# Altium schematic sheet beaglebone.SchDoc: Beaglebone
size A4; Organization: Badgerloop Electrical; Address1: 133 Engineering Research Building; Address2: 1500 Engineering Drive; Address3: Madison, Wi 53706
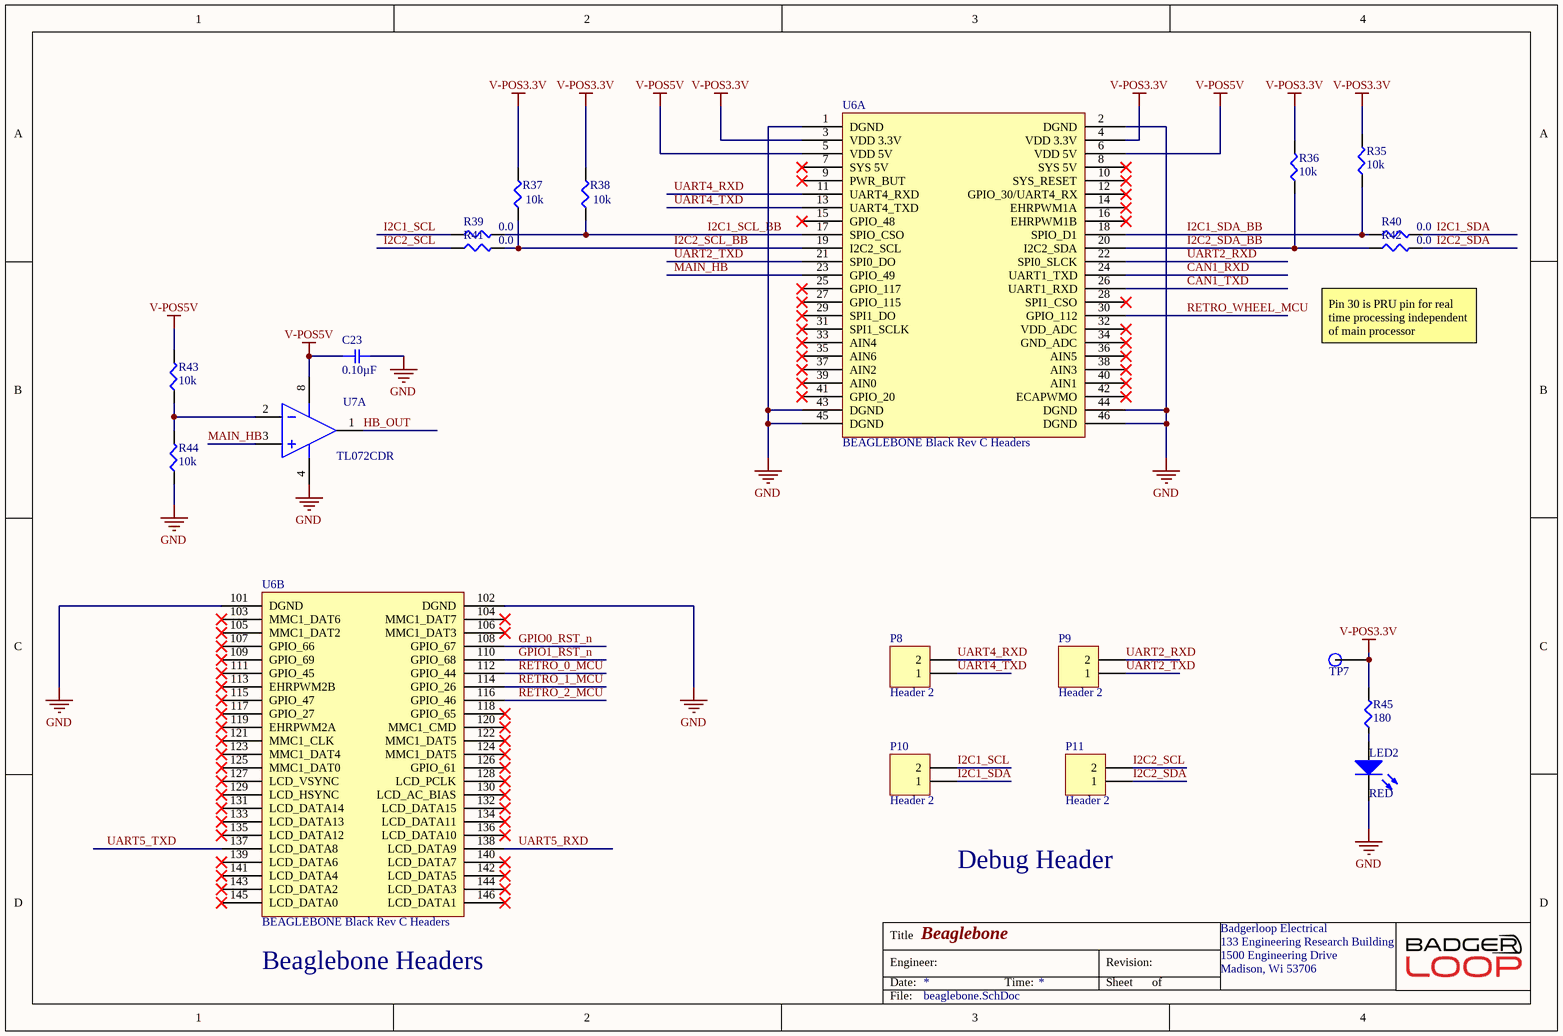
[diagram p0: beaglebone.SchDoc]

## Parts
C23  0.10µF  [SMD-0805C]
LED2  RED  [LED 0603 RED]
P8  Header 2  [Pin Header 1x2 TH Pitch 2.54mm]
P9  Header 2  [Pin Header 1x2 TH Pitch 2.54mm]
P10  Header 2  [Pin Header 1x2 TH Pitch 2.54mm]
P11  Header 2  [Pin Header 1x2 TH Pitch 2.54mm]
R35  10k  [SMD-0805-RES]
R36  10k  [SMD-0805-RES]
R37  10k  [SMD-0805-RES]
R38  10k  [SMD-0805-RES]
R39  0.0  [SMD-1206-RES]
R40  0.0  [SMD-1206-RES]
R41  0.0  [SMD-1206-RES]
R42  0.0  [SMD-1206-RES]
R43  10k  [SMD-0805-RES]
R44  10k  [SMD-0805-RES]
R45  180  [SMD-0805-RES]
TP7  TP  [Test Point]  (value not drawn)
U6  BEAGLEBONE Black Rev C Headers  [Beaglebone_Topside]  (parts A,B of 2)
U7  TL072CDR  [SOP127P600X175-8N]  (part A of 2)

## Nets
GND: C23.2 LED2.2(K) R44.1 U6.1(DGND) U6.2(DGND) U6.43(DGND) U6.44(DGND) U6.45(DGND) U6.46(DGND) U6.101(DGND) U6.102(DGND) U7.4(V-)
V-POS3.3V: R35.2 R36.2 R37.2 R38.2 R45.2 TP7.1 U6.3(VDD_3.3V) U6.4(VDD_3.3V)
V-POS5V: C23.1 R43.2 U6.5(VDD_5V) U6.6(VDD_5V) U7.8(V+)
CAN1_RXD: U6.24(UART1_TXD)
CAN1_TXD: U6.26(UART1_RXD)
GPIO0_RST_n: U6.108(GPIO_67)
GPIO1_RST_n: U6.110(GPIO_68)
HB_OUT: U7.1(OUT)
I2C1_SCL: P10.2 R39.1
I2C1_SCL_BB: R38.1 R39.2 U6.17(SPIO_CSO)
I2C1_SDA: P10.1 R40.2
I2C1_SDA_BB: R35.1 R40.1 U6.18(SPIO_D1)
I2C2_SCL: P11.2 R41.1
I2C2_SCL_BB: R37.1 R41.2 U6.19(I2C2_SCL)
I2C2_SDA: P11.1 R42.2
I2C2_SDA_BB: R36.1 R42.1 U6.20(I2C2_SDA)
MAIN_HB: U6.23(GPIO_49) U7.3(IN+)
RETRO_0_MCU: U6.112(GPIO_44)
RETRO_1_MCU: U6.114(GPIO_26)
RETRO_2_MCU: U6.116(GPIO_46)
RETRO_WHEEL_MCU: U6.30(GPIO_112)
UART2_RXD: P9.2 U6.22(SPI0_SLCK)
UART2_TXD: P9.1 U6.21(SPI0_DO)
UART4_RXD: P8.2 U6.11(UART4_RXD)
UART4_TXD: P8.1 U6.13(UART4_TXD)
UART5_RXD: U6.138(LCD_DATA9)
UART5_TXD: U6.137(LCD_DATA8)
NetLED2_1: LED2.1(A) R45.1
NetR43_1: R43.1 R44.2 U7.2(IN-)

Not connected (* = marked no-connect by the designer): U6 7(SYS_5V)* 8(SYS_5V)* 9(PWR_BUT)* 10(SYS_RESET)* 12(GPIO_30/UART4_RX)* 14(EHRPWM1A)* 15(GPIO_48)* 16(EHRPWM1B)* 25(GPIO_117)* 27(GPIO_115)* 28(SPI1_CSO)* 29(SPI1_DO)* 31(SPI1_SCLK)* 32(VDD_ADC)* 33(AIN4)* 34(GND_ADC)* 35(AIN6)* 36(AIN5)* 37(AIN2)* 38(AIN3)* 39(AIN0)* 40(AIN1)* 41(GPIO_20)* 42(ECAPWMO)* 103(MMC1_DAT6)* 104(MMC1_DAT7)* 105(MMC1_DAT2)* 106(MMC1_DAT3)* 107(GPIO_66)* 109(GPIO_69)* 111(GPIO_45)* 113(EHRPWM2B)* 115(GPIO_47)* 117(GPIO_27)* 118(GPIO_65)* 119(EHRPWM2A)* 120(MMC1_CMD)* 121(MMC1_CLK)* 122(MMC1_DAT5)* 123(MMC1_DAT4)* 124(MMC1_DAT5)* 125(MMC1_DAT0)* 126(GPIO_61)* 127(LCD_VSYNC)* 128(LCD_PCLK)* 129(LCD_HSYNC)* 130(LCD_AC_BIAS)* 131(LCD_DATA14)* 132(LCD_DATA15)* 133(LCD_DATA13)* 134(LCD_DATA11)* 135(LCD_DATA12)* 136(LCD_DATA10)* 139(LCD_DATA6)* 140(LCD_DATA7)* 141(LCD_DATA4)* 142(LCD_DATA5)* 143(LCD_DATA2)* 144(LCD_DATA3)* 145(LCD_DATA0)* 146(LCD_DATA1)*

## Notes on the sheet
- Pin 30 is PRU pin for real time processing independent of main processor
- Debug Header
- (near U6) Beaglebone Headers
- Title
- Engineer:
- Date:
- Time:
- Revision:
- Sheet
- of
- File:

## Library data of the parts
C23 = GRM21B7U1A104JA01L: CAP CER 0.1UF 10V U2J 0805; Manufacturer: Murata Electronics North America; Factory Stock: 0; Unit Price (USD): 0.4; Minimum Quantity: 1; Tolerance: ±5%; Datasheets: http://www.murata.com/~/media/webrenewal/support/library/catalog/products/capacitor/mlcc/c02e.pdf; Image: //media.digikey.com/Renders/Murata%20Renders/0805%20(2012%20Metric)%20.85mm.jpg; Digi-Key Part Number: 490-11592-1-ND; Part Number: GRM21B7U1A104JA01L; Quantity Available: 3390; @ qty: 0; Packaging: Cut Tape (CT); Series: GRM; Part Status: Active; Value: 0.10µF; Voltage: 10V; Temperature Coefficient: U2J; Operating Temperature: -55°C ~ 125°C; Features: -; Ratings: -; Applications: General Purpose; Mounting Type: Surface Mount, MLCC; Package / Case: 0805 (2012 Metric); Size / Dimension: 0.079" L x 0.049" W (2.00mm x 1.25mm); Height - Seated (Max): -; Thickness (Max): 0.053" (1.35mm); Lead Spacing: -; Lead Style: -
LED2 = LED RED 0603: Red 631nm LED Indication - Discrete 2V 0603 (1608 Metric); Manufacturer: Lite-On Inc.; Manufacturer P/N: LTST-C190KRKT; Digikey P/N: 160-1436-1-ND; Package / Case: 0603; Color: RED
P8-P11 = Header 2: Header, 2-Pin; LatestRevisionDate: 17-Jul-2002; LatestRevisionNote: Re-released for DXP Platform.; Publisher: Altium Limited
R35-R38 = ERJ-6GEYJ103V: RES SMD 10K OHM 5% 1/8W 0805; Manufacturer: Panasonic Electronic Components; Factory Stock: 0; Unit Price (USD): 0.00496; @ qty: 1500; Minimum Quantity: 1; Power (Watts): 0.125W, 1/8W; Temperature Coefficient: ±200ppm/°C; Part Number: ERJ-6GEYJ103V; Datasheets: http://industrial.panasonic.com/www-cgi/jvcr13pz.cgi?E+PZ+3+AOA0001+ERJ6GEYJ103V+7+WW; Image: //media.digikey.com/Renders/Panasonic%20Renders/ERJ-0805%20Pkg.jpg; Digi-Key Part Number: P10KACT-ND; Quantity Available: 2328224; Packaging: Cut Tape (CT); Series: ERJ; Part Status: Active; Value: 10k; Tolerance: ±5%; Composition: Thick Film; Features: Automotive AEC-Q200; Operating Temperature: -55°C ~ 155°C; Package / Case: 0805 (2012 Metric); Supplier Device Package: 0805; Size / Dimension: 0.079" L x 0.049" W (2.00mm x 1.25mm); Height - Seated (Max): 0.028" (0.70mm); Number of Terminations: 2; Failure Rate: -
R39-R42 = ERJ-8GEY0R00V: RES SMD 0.0 OHM JUMPER 1/4W 1206; Manufacturer: Panasonic Electronic Components; Factory Stock: 0; Unit Price (USD): 0.00768; @ qty: 1500; Minimum Quantity: 1; Power (Watts): 0.25W, 1/4W; Part Number: ERJ-8GEY0R00V; Datasheets: http://industrial.panasonic.com/www-cgi/jvcr13pz.cgi?E+PZ+3+AOA0001+ERJ8GEY0R00V+7+WW; Image: //media.digikey.com/Renders/Panasonic%20Renders/ERJ-1206%20Pkg.jpg; Digi-Key Part Number: P0.0ECT-ND; Quantity Available: 1074190; Packaging: Cut Tape (CT); Series: ERJ; Part Status: Active; Value: 0.0; Tolerance: Jumper; Composition: Thick Film; Features: Automotive AEC-Q200; Temperature Coefficient: -; Operating Temperature: -55°C ~ 155°C; Package / Case: 1206 (3216 Metric); Supplier Device Package: 1206; Size / Dimension: 0.126" L x 0.063" W (3.20mm x 1.60mm); Height - Seated (Max): 0.028" (0.70mm); Number of Terminations: 2; Failure Rate: -
R43 R44 = ERJ-P06J103V: RES SMD 10K OHM 5% 1/2W 0805; Manufacturer: Panasonic Electronic Components; Factory Stock: 0; Unit Price (USD): 0.01839; @ qty: 1500; Minimum Quantity: 1; Power (Watts): 0.5W, 1/2W; Temperature Coefficient: ±200ppm/°C; Part Number: ERJ-P06J103V; Datasheets: https://industrial.panasonic.com/cdbs/www-data/pdf/RDA0000/AOA0000C243.pdf; Image: //media.digikey.com/Renders/Panasonic%20Renders/ERJ-0805%20Pkg.jpg; Digi-Key Part Number: P10KADCT-ND; Quantity Available: 413576; Packaging: Cut Tape (CT); Series: ERJ; Part Status: Active; Value: 10k; Tolerance: ±5%; Composition: Thick Film; Features: Automotive AEC-Q200, Pulse Withstanding; Operating Temperature: -55°C ~ 155°C; Package / Case: 0805 (2012 Metric); Supplier Device Package: 0805; Size / Dimension: 0.079" L x 0.049" W (2.00mm x 1.25mm); Height - Seated (Max): 0.028" (0.70mm); Number of Terminations: 2; Failure Rate: -
R45 = ERJ-6ENF1800V: RES SMD 180 OHM 1% 1/8W 0805; Manufacturer: Panasonic Electronic Components; Factory Stock: 0; Unit Price (USD): 0.00729; @ qty: 1500; Minimum Quantity: 1; Power (Watts): 0.125W, 1/8W; Temperature Coefficient: ±100ppm/°C; Part Number: ERJ-6ENF1800V; Datasheets: http://industrial.panasonic.com/www-cgi/jvcr13pz.cgi?E+PZ+3+AOA0002+ERJ6ENF1800V+7+WW; Image: //media.digikey.com/Renders/Panasonic%20Renders/ERJ-0805%20Pkg.jpg; Digi-Key Part Number: P180CCT-ND; Quantity Available: 33231; Packaging: Cut Tape (CT); Series: ERJ; Part Status: Active; Value: 180; Tolerance: ±1%; Composition: Thick Film; Features: Automotive AEC-Q200; Operating Temperature: -55°C ~ 155°C; Package / Case: 0805 (2012 Metric); Supplier Device Package: 0805; Size / Dimension: 0.079" L x 0.049" W (2.00mm x 1.25mm); Height - Seated (Max): 0.028" (0.70mm); Number of Terminations: 2; Failure Rate: -
TP7 = TP: SMD TEST POINT
U6 = Beaglebone: Beaglebone Black Rev C Header
U7 = TL072CDR: IC OPAMP JFET 3MHZ 8SOIC; Manufacturer: Texas Instruments; Voltage Gain: 106.02dB; Min Dual Supply Voltage: 3.5V; Max Dual Supply Voltage: 18V; Nominal Supply Current: 5mA; Common Mode Rejection Ratio: 70dB; Number of Channels: 2; Slew Rate: 13V/µs; Max I/O Voltage: 10mV; Input Bias Current: 200pA; Operating Supply Current: 1.4mA; Dual Supply Voltage: 9V; Supplier 1: Digi-Key; Stock 1: 21821; Pricing 1: 1=0.41, 10=0.334, 100=0.2059, 500=0.1562, 1000=0.11715 (USD); Case/Package: D; Number of Pins: 8; Contact Plating: Gold; Min Operating Temperature: -40°C; Max Operating Temperature: 85°C; Package Quantity: 1; Packaging: Tape and Reel; Unity Gain Bandwidth Product: 3MHz; Bandwidth: 3MHz; Nominal Gain Bandwidth Product: 3MHz; Number of Circuits: 2; Gain Bandwidth Product: 3MHz; Input Offset Voltage (Vos): 10mV; Number of Elements: 2; Max Supply Voltage: 18V; Number of Amplifiers: 2; Length: 4.9mm; Height: 1.58mm; Width: 3.91mm; Radiation Hardening: No; Lead Free: Lead Free; REACH SVHC: No SVHC; ComponentLink1URL: http://www.ti.com/lit/ds/symlink/tl071a.pdf?src-supplier=Digi-Key; ComponentLink1Description: http://www.ti.com/lit/ds/symlink/tl071a.pdf?src-supplier=Digi-Key; ComponentLink2URL: http://www.ti.com/general/docs/lit/getliterature.tsp?genericPartNumber=TL072&&fileType=pdf&src-supplier=Avnet; ComponentLink2Description: http://www.ti.com/general/docs/lit/getliterature.tsp?genericPartNumber=TL072&&fileType=pdf&src-supplier=Avnet; ComponentLink3URL: http://www.farnell.com/datasheets/1882732.pdf?src-supplier=Element14; ComponentLink3Description: http://www.farnell.com/datasheets/1882732.pdf?src-supplier=Element14; Supplier Part Number 1: 296-1282-6-ND